# EAGLE board zx81 SD_09 (EAGLE 9.6.2), part 1 of 2
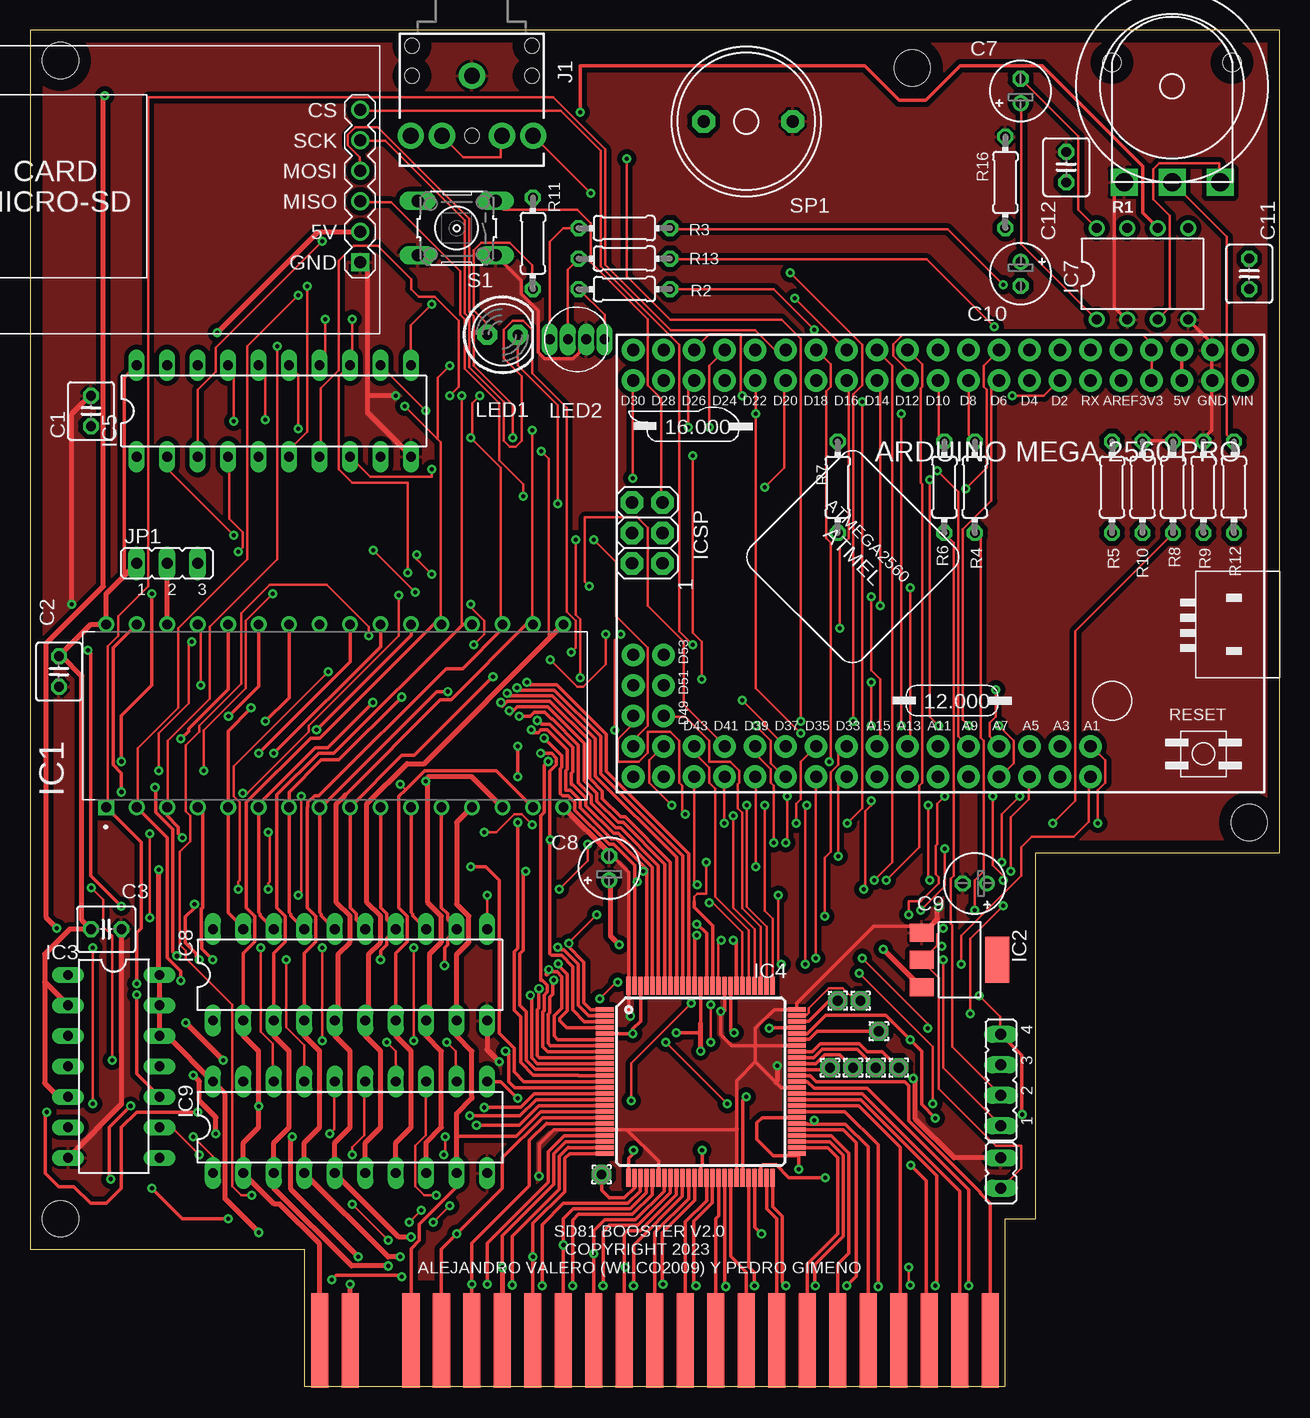
[diagram p2: board, top side]
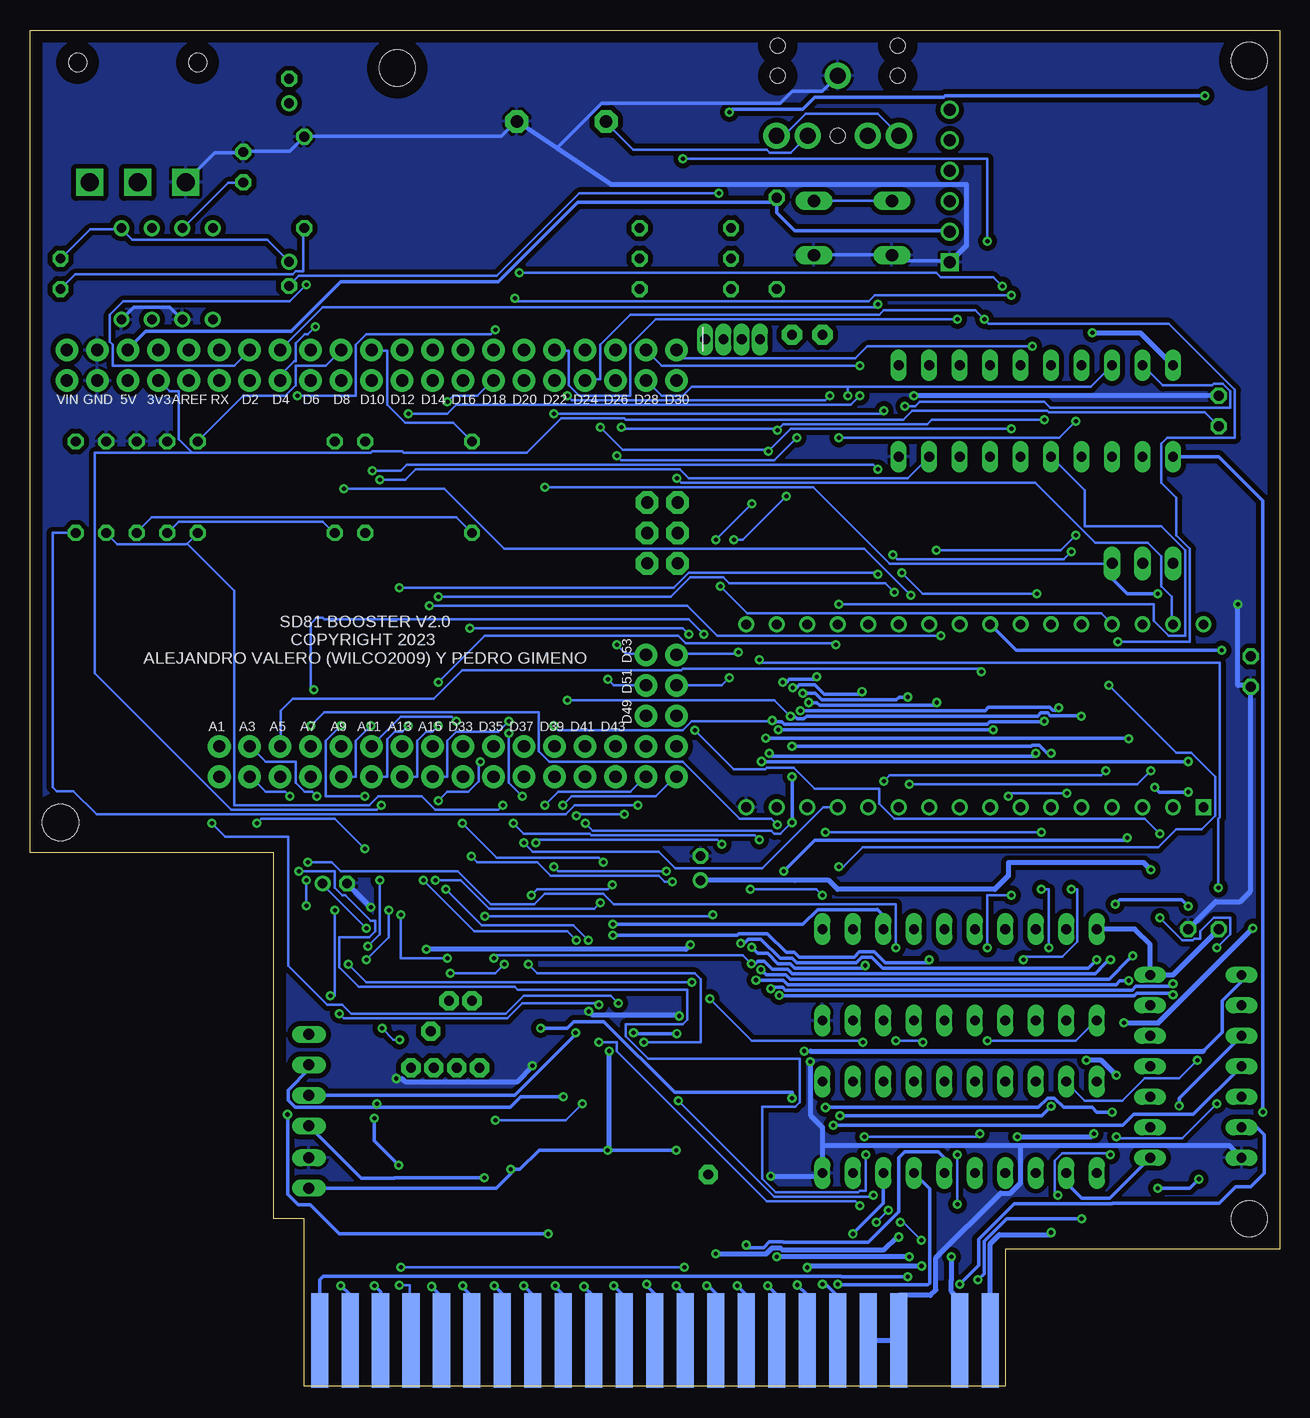
[diagram p3: board, bottom side, seen from below]

Size 104.14 x 113.03 mm. Coordinates in mm from the lower left corner, seen from the top.
Outline: 22.86,0 81.28,0 81.28,13.97 83.82,13.97 83.82,44.45 104.14,44.45 104.14,113.03 0,113.03 0,11.43 22.86,11.43 22.86,0
Copper layers (1*16): Top 0.035mm / dielectric 1.5mm / Bottom 0.035mm
Design rules "default *": minimum track width 0.2mm, minimum drill 0.35mm, track to track 6mil, track to pad 6mil, pad to pad 6mil, via to via 6mil, smd to smd 6mil, copper to edge 40mil, drill to drill 6mil, minimum pad ring 10mil, minimum via ring 8mil, stop-mask expansion 4mil, vias tented up to drill 0mil, thermal gap 10mil
Net classes: 0 default: width 0.127 mm, drill 0.2 mm, clearance 0.127 mm; 1 VCC: width 0.3 mm; 2 3,3: width 0.4 mm, drill 0.5 mm, clearance 0.152 mm to class 0
Holes 3 mm at 2.54,110.49 73.53,109.86 2.54,13.97 101.6,46.99

## Footprints (pad centres in the part's own frame; a part is rotated, then mirrored left to right if it is on the bottom)
EDGEPIN = smd 1.422 x 7.874: 1 0,0
C025-040X050 = drill 0.813 octagon: 1 -1.27,0; 2 1.27,0
E2-5 = drill 0.813 pad 1.27: + -1.016,0 | drill 0.813 pad 1.27 octagon: - 1.016,0
DIP1524W45P254L4203H406Q32 = drill 0.81 pad 1.22 square: 1 -7.62,19.05 | drill 0.81 pad 1.22: 2 -7.62,16.51; 3 -7.62,13.97; 4 -7.62,11.43; 5 -7.62,8.89; 6 -7.62,6.35; 7 -7.62,3.81; 8 -7.62,1.27; 9 -7.62,-1.27; 10 -7.62,-3.81; 11 -7.62,-6.35; 12 -7.62,-8.89; 13 -7.62,-11.43; 14 -7.62,-13.97; 15 -7.62,-16.51; 16 -7.62,-19.05; 17 7.62,-19.05; 18 7.62,-16.51; 19 7.62,-13.97; 20 7.62,-11.43; 21 7.62,-8.89; 22 7.62,-6.35; 23 7.62,-3.81; 24 7.62,-1.27; 25 7.62,1.27; 26 7.62,3.81; 27 7.62,6.35; 28 7.62,8.89; 29 7.62,11.43; 30 7.62,13.97; 31 7.62,16.51; 32 7.62,19.05
SOT223 = smd 1.499 x 2.007: 1 -2.261,-3.15; 2 0.025,-3.15; 3 2.311,-3.15 | smd 3.81 x 2.007: 4 0,3.15
DIL14 = drill 0.813 long: 1 -7.62,-3.81; 2 -5.08,-3.81; 3 -2.54,-3.81; 4 0,-3.81; 5 2.54,-3.81; 6 5.08,-3.81; 7 7.62,-3.81; 8 7.62,3.81; 9 5.08,3.81; 10 2.54,3.81; 11 0,3.81; 12 -2.54,3.81; 13 -5.08,3.81; 14 -7.62,3.81
TQFP100 = smd 1.5 x 0.345: 1 -8,6; 2 -8,5.5; 3 -8,5; 4 -8,4.5; 5 -8,4; 6 -8,3.5; 7 -8,3; 8 -8,2.5; 9 -8,2; 10 -8,1.5; 11 -8,1; 12 -8,0.5; 13 -8,0; 14 -8,-0.5; 15 -8,-1; 16 -8,-1.5; 17 -8,-2; 18 -8,-2.5; 19 -8,-3; 20 -8,-3.5; 21 -8,-4; 22 -8,-4.5; 23 -8,-5; 24 -8,-5.5; 25 -8,-6; 51 8,-6; 52 8,-5.5; 53 8,-5; 54 8,-4.5; 55 8,-4; 56 8,-3.5; 57 8,-3; 58 8,-2.5; 59 8,-2; 60 8,-1.5; 61 8,-1; 62 8,-0.5; 63 8,0; 64 8,0.5; 65 8,1; 66 8,1.5; 67 8,2; 68 8,2.5; 69 8,3; 70 8,3.5; 71 8,4; 72 8,4.5; 73 8,5; 74 8,5.5; 75 8,6 | smd 0.345 x 1.5: 26 -6,-8; 27 -5.5,-8; 28 -5,-8; 29 -4.5,-8; 30 -4,-8; 31 -3.5,-8; 32 -3,-8; 33 -2.5,-8; 34 -2,-8; 35 -1.5,-8; 36 -1,-8; 37 -0.5,-8; 38 0,-8; 39 0.5,-8; 40 1,-8; 41 1.5,-8; 42 2,-8; 43 2.5,-8; 44 3,-8; 45 3.5,-8; 46 4,-8; 47 4.5,-8; 48 5,-8; 49 5.5,-8; 50 6,-8; 76 6,8; 77 5.5,8; 78 5,8; 79 4.5,8; 80 4,8; 81 3.5,8; 82 3,8; 83 2.5,8; 84 2,8; 85 1.5,8; 86 1,8; 87 0.5,8; 88 0,8; 89 -0.5,8; 90 -1,8; 91 -1.5,8; 92 -2,8; 93 -2.5,8; 94 -3,8; 95 -3.5,8; 96 -4,8; 97 -4.5,8; 98 -5,8; 99 -5.5,8; 100 -6,8
DIL20 = drill 0.813 long: 1 -11.43,-3.81; 2 -8.89,-3.81; 3 -6.35,-3.81; 4 -3.81,-3.81; 5 -1.27,-3.81; 6 1.27,-3.81; 7 3.81,-3.81; 8 6.35,-3.81; 9 8.89,-3.81; 10 11.43,-3.81; 11 11.43,3.81; 12 8.89,3.81; 13 6.35,3.81; 14 3.81,3.81; 15 1.27,3.81; 16 -1.27,3.81; 17 -3.81,3.81; 18 -6.35,3.81; 19 -8.89,3.81; 20 -11.43,3.81
DIL08 = drill 0.813 pad 1.27: 1 -3.81,-3.81; 2 -1.27,-3.81; 3 1.27,-3.81; 4 3.81,-3.81; 5 3.81,3.81; 6 1.27,3.81; 7 -1.27,3.81; 8 -3.81,3.81
AUDIO-JACK-KIT = drill 1.3 pad 2.184: RING 5,5.1; RSH 5,2.5; SLEEVE 0,0; TIP 5,-5.1; TSH 5,-2.5 | hole 1.2: 0,5; -2.5,5; -2.5,-5; 0,-5; 5,0
JP2 = drill 0.914 long: 1 -2.54,0; 2 0,0; 3 2.54,0
JP1 = drill 0.914 long: 1 0,-1.27; 2 0,1.27
JP4 = drill 0.914 long: 1 -3.81,0; 2 -1.27,0; 3 1.27,0; 4 3.81,0
LED5MM = drill 0.813 pad 1.676 octagon: A -1.27,0; K 1.27,0
LED-RGB-THRU = drill 0.813 long: 1 2.286,0; 2 0.762,0; 3 -0.762,0; 4 -2.286,0
1,6/0,8 = drill 0.813 pad 1.6 octagon: 1 0,0
POT-WHEEL = drill 1.5 square: P$1 1,0; P$2 5,0; P$3 9,0 | hole 1.5: 0,10; 10,10
0204/7 = drill 0.813 octagon: 1 -3.81,0; 2 3.81,0
B3F-10XX = drill 1.016 long: 1 -3.251,2.261; 2 3.251,2.261; 3 -3.251,-2.261; 4 3.251,-2.261
ALT = drill 1.016 pad 1.905 octagon: + 3.873,0; - -3.556,0
ARDUINO_MEGA2560_PRO = drill 1.016 pad 1.88: 3V3_1 9.42,3.81; 3V3_2 9.42,1.27; 5V1 6.88,3.81; 5V2 6.88,1.27; A0 14.5,36.83; A1 14.5,34.29; A2 17.04,36.83; A3 17.04,34.29; A4 19.58,36.83; A5 19.58,34.29; A6 22.12,36.83; A7 22.12,34.29; A8 24.66,36.83; A9 24.66,34.29; A10 27.2,36.83; A11 27.2,34.29; A12 29.74,36.83; A13 29.74,34.29; A14 32.28,36.83; A15 32.28,34.29; AREF 11.96,3.81; D2 17.04,3.81; D3 17.04,1.27; D4 19.58,3.81; D5 19.58,1.27; D6 22.12,3.81; D7 22.12,1.27; D8 24.66,3.81; D9 24.66,1.27; D10 27.2,3.81; D11 27.2,1.27; D12 29.74,3.81; D13 29.74,1.27; D14 32.28,3.81; D15 32.28,1.27; D16 34.82,3.81; D17 34.82,1.27; D18 37.36,3.81; D19 37.36,1.27; D20 39.9,3.81; D21 39.9,1.27; D22 42.44,3.81; D23 42.44,1.27; D24 44.98,3.81; D25 44.98,1.27; D26 47.52,3.81; D27 47.52,1.27; D28 50.06,3.81; D29 50.06,1.27; D30 52.6,3.81; D31 52.6,1.27; D32 34.82,36.83; D33 34.82,34.29; D34 37.36,36.83; D35 37.36,34.29; D36 39.9,36.83; D37 39.9,34.29; D38 42.44,36.83; D39 42.44,34.29; D40 44.98,36.83; D41 44.98,34.29; D42 47.52,36.83; D43 47.52,34.29; D44 50.06,36.83; D45 50.06,34.29; D46 52.6,36.83; D47 52.6,34.29; D48 52.6,31.75; D49 50.06,31.75; D50 52.6,29.21; D51 50.06,29.21; D52 52.6,26.67; D53 50.06,26.67; GND1 4.34,3.81; GND2 4.34,1.27; RST 11.96,1.27; RX 14.5,3.81; TX 14.5,1.27; VIN1 1.8,3.81; VIN2 1.8,1.27 | drill 1.016 pad 1.88 octagon: +5V_ 52.705,19.05; GND__ 52.705,13.97; MISO 50.165,19.05; MOSI 52.705,16.51; RESET. 50.165,13.97; SCK 50.165,16.51
MICROSD-MODULE = drill 1: CS 1.703,5.391; MISO 1.703,13.011; MOSI 1.703,10.471; SCK 1.703,7.931; VCC 1.703,15.551 | drill 1 square: GND 1.703,18.091

## Placement (x,y rotation side)
1A  D7  [EDGEPIN]  24.13,3.81 0 top
1B  VCC  [EDGEPIN]  24.13,3.81 180 bottom
2A  /RAMCS  [EDGEPIN]  26.67,3.81 0 top
2B  9V  [EDGEPIN]  26.67,3.81 180 bottom
4A  D0  [EDGEPIN]  31.75,3.81 0 top
4B  GND  [EDGEPIN]  31.75,3.81 180 bottom
5A  D1  [EDGEPIN]  34.29,3.81 0 top
5B  GND  [EDGEPIN]  34.29,3.81 180 bottom
6A  D2  [EDGEPIN]  36.83,3.81 0 top
6B  /CLOCK  [EDGEPIN]  36.83,3.81 180 bottom
7A  D6  [EDGEPIN]  39.37,3.81 0 top
7B  A0  [EDGEPIN]  39.37,3.81 180 bottom
8A  D5  [EDGEPIN]  41.91,3.81 0 top
8B  A1  [EDGEPIN]  41.91,3.81 180 bottom
9A  D3  [EDGEPIN]  44.45,3.81 0 top
9B  A2  [EDGEPIN]  44.45,3.81 180 bottom
10A  D4  [EDGEPIN]  46.99,3.81 0 top
10B  A3  [EDGEPIN]  46.99,3.81 180 bottom
11A  A6  [EDGEPIN]  49.53,3.81 0 top
11B  A15  [EDGEPIN]  49.53,3.81 180 bottom
12A  /NMI  [EDGEPIN]  52.07,3.81 0 top
12B  A14  [EDGEPIN]  52.07,3.81 180 bottom
13A  /HALT  [EDGEPIN]  54.61,3.81 0 top
13B  A13  [EDGEPIN]  54.61,3.81 180 bottom
14A  /MREQ  [EDGEPIN]  57.15,3.81 0 top
14B  A12  [EDGEPIN]  57.15,3.81 180 bottom
15A  /IORQ  [EDGEPIN]  59.69,3.81 0 top
15B  A11  [EDGEPIN]  59.69,3.81 180 bottom
16A  /RD  [EDGEPIN]  62.23,3.81 0 top
16B  A10  [EDGEPIN]  62.23,3.81 180 bottom
17A  /WR  [EDGEPIN]  64.77,3.81 0 top
17B  A9  [EDGEPIN]  64.77,3.81 180 bottom
18A  /BUSAK  [EDGEPIN]  67.31,3.81 0 top
18B  A8  [EDGEPIN]  67.31,3.81 180 bottom
19A  /WAIT  [EDGEPIN]  69.85,3.81 0 top
19B  A7  [EDGEPIN]  69.85,3.81 180 bottom
20A  /BUSRQ  [EDGEPIN]  72.39,3.81 0 top
20B  A6  [EDGEPIN]  72.39,3.81 180 bottom
21A  /RESET  [EDGEPIN]  74.93,3.81 0 top
21B  A5  [EDGEPIN]  74.93,3.81 180 bottom
22A  /M1  [EDGEPIN]  77.47,3.81 0 top
22B  A4  [EDGEPIN]  77.47,3.81 180 bottom
23A  /RFSH  [EDGEPIN]  80.01,3.81 0 top
23B  /ROMCS  [EDGEPIN]  80.01,3.81 180 bottom
C1  100nF  [C025-040X050]  5.08,81.28 90 top
C2  100nF  [C025-040X050]  2.41,59.56 270 top
C3  100nF  [C025-040X050]  6.35,38.1 0 top
C7  10uF  [E2-5]  82.55,107.95 90 top
C8  100uF  [E2-5]  48.26,43.18 90 top
C9  100uF  [E2-5]  78.74,41.91 180 top
C10  250uF  [E2-5]  82.55,92.71 270 top
C11  0.05uF  [C025-040X050]  101.6,92.71 270 top
C12  100nF  [C025-040X050]  86.36,101.6 90 top
IC1  AS6C4008-55PIN  [DIP1524W45P254L4203H406Q32]  25.4,55.88 90 top
IC2  REG1117  [SOT223]  77.47,35.56 270 top
IC3  74ACT125N  [DIL14]  6.98,26.67 270 top
IC4  XC95144XL-10TQG100C  [TQFP100]  55.88,25.4 0 top
IC5  74HC573N  [DIL20]  20.32,81.28 0 top
IC7  LM386N-4  [DIL08]  92.71,92.71 0 top
IC8  74HC573N  [DIL20]  26.67,34.29 0 top
IC9  74HC573N  [DIL20]  26.67,21.59 0 top
J1  AUDIO_JACK_3.5MM_KIT  [AUDIO-JACK-KIT]  36.83,109.22 270 top
JP1  512K/32K  [JP2]  11.43,68.58 0 top
JP2  [JP1]  80.9,17.78 0 top
JP3  JTAG  [JP4]  80.9,25.53 90 top
LED1  SD  [LED5MM]  39.37,87.63 0 top
LED2  STATUS  [LED-RGB-THRU]  45.59,87.25 0 top
PAD1  [1,6/0,8]  47.62,17.65 0 top
PAD2  [1,6/0,8]  66.67,26.54 0 top
PAD3  [1,6/0,8]  68.58,26.54 0 top
PAD4  [1,6/0,8]  70.48,26.54 0 top
PAD5  [1,6/0,8]  72.39,26.54 0 top
PAD6  [1,6/0,8]  67.31,32.13 0 top
PAD7  [1,6/0,8]  70.74,29.59 0 top
PAD8  [1,6/0,8]  69.22,32.13 0 top
R1  10K  [POT-WHEEL]  90.17,100.33 0 top
R2  150  [0204/7]  49.53,91.44 180 top
R3  68  [0204/7]  49.53,96.52 180 top
R4  180  [0204/7]  78.74,74.93 270 top
R5  180  [0204/7]  90.17,74.93 270 top
R6  100  [0204/7]  76.2,74.93 270 top
R7  180  [0204/7]  67.31,74.93 270 top
R8  330  [0204/7]  95.25,74.93 270 top
R9  330  [0204/7]  97.79,74.93 270 top
R10  330  [0204/7]  92.71,74.93 270 top
R11  680  [0204/7]  41.91,95.25 270 top
R12  1K  [0204/7]  100.33,74.93 90 top
R13  150  [0204/7]  49.53,93.98 180 top
R16  10  [0204/7]  81.28,100.33 270 top
S1  ARDUINO RESET  [B3F-10XX]  35.56,96.52 180 top
SP1  AL11PALT  [ALT]  59.69,105.41 0 top
U$2  ARDUINO_MEGA2560_PRO  [ARDUINO_MEGA2560_PRO]  102.87,87.63 180 top
U$3  MICRO-SD-MODULE  [MICROSD-MODULE]  29.21,111.76 180 top